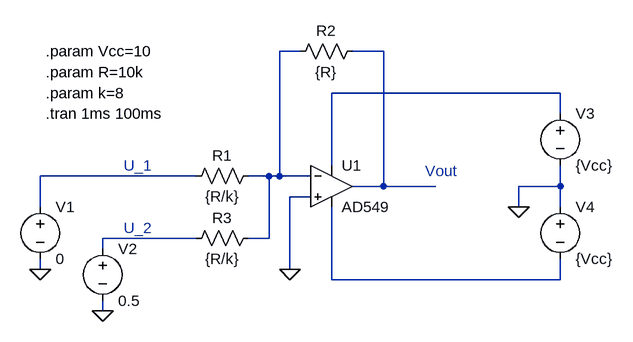
[diagram p0: schematic scheme4.asc]
scheme4.asc, the LTspice schematic file:
Version 4.1
SHEET 1 1032 680
WIRE 480 -32 448 -32
WIRE 608 -32 560 -32
WIRE 880 32 528 32
WIRE 880 64 880 32
WIRE 528 144 528 32
WIRE 320 160 80 160
WIRE 432 160 400 160
WIRE 448 160 448 -32
WIRE 448 160 432 160
WIRE 496 160 448 160
WIRE 608 176 608 -32
WIRE 608 176 560 176
WIRE 688 176 608 176
WIRE 880 176 880 144
WIRE 880 176 816 176
WIRE 496 192 464 192
WIRE 80 208 80 160
WIRE 816 208 816 176
WIRE 880 208 880 176
WIRE 320 256 176 256
WIRE 432 256 432 160
WIRE 432 256 400 256
WIRE 176 272 176 256
WIRE 80 304 80 288
WIRE 464 304 464 192
WIRE 528 320 528 208
WIRE 880 320 880 288
WIRE 880 320 528 320
WIRE 176 368 176 352
FLAG 80 304 0
FLAG 176 368 0
FLAG 816 208 0
FLAG 464 304 0
SYMBOL voltage 80 192 R0
SYMATTR InstName V1
SYMATTR Value 0
SYMBOL voltage 176 256 R0
SYMATTR InstName V2
SYMATTR Value 0.5
SYMBOL res 416 144 R90
WINDOW 0 0 56 VBottom 2
WINDOW 3 32 56 VTop 2
SYMATTR InstName R1
SYMATTR Value {R/k}
SYMBOL res 576 -48 R90
WINDOW 0 0 56 VBottom 2
WINDOW 3 32 56 VTop 2
SYMATTR InstName R2
SYMATTR Value {R}
SYMBOL res 416 240 R90
WINDOW 0 0 56 VBottom 2
WINDOW 3 32 56 VTop 2
SYMATTR InstName R3
SYMATTR Value {R/k}
SYMBOL OpAmps\\AD549 528 112 R0
SYMATTR InstName U1
SYMBOL voltage 880 48 R0
SYMATTR InstName V3
SYMATTR Value {Vcc}
SYMBOL voltage 880 192 R0
SYMATTR InstName V4
SYMATTR Value {Vcc}
TEXT 672 152 Left 2 ;Vout
TEXT 208 144 Left 2 ;U_1
TEXT 208 240 Left 2 ;U_2
TEXT 88 -32 Left 2 !.param Vcc=10
TEXT 88 0 Left 2 !.param R=10k
TEXT 88 32 Left 2 !.param k=8
TEXT 88 64 Left 2 !.tran 1ms 100ms

The netlist it stands for:
* scheme4.asc
V1 N004 0 0
V2 N005 0 0.5
R1 N001 N004 {R/k}
R2 N002 N001 {R}
R3 N001 N005 {R/k}
X§U1 0 N001 N003 N006 N002 AD549  ; pins In+ In- V+ V- OUT
V3 N003 0 {Vcc}
V4 0 N006 {Vcc}
* Vout
* U_1
* U_2
.param Vcc=10
.param R=10k
.param k=8
.tran 1ms 100ms
.backanno
.end